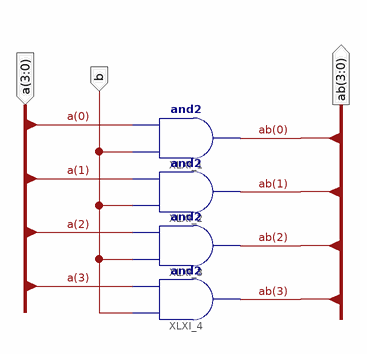
[diagram p0: schematic sheet 1]
// Xilinx ISE schematic extend_and_4bit.sch (spartan3e) as structural Verilog: 4 symbols, 3 ports
module extend_and_4bit (
  input  [3:0] a,
  input  b,
  output [3:0] ab
);

  and XLXI_1 (ab[0], b, a[0]);
  and XLXI_2 (ab[1], b, a[1]);
  and XLXI_3 (ab[2], b, a[2]);
  and XLXI_4 (ab[3], b, a[3]);
endmodule
